# Altium schematic sheet microcontroller.SchDoc
size A
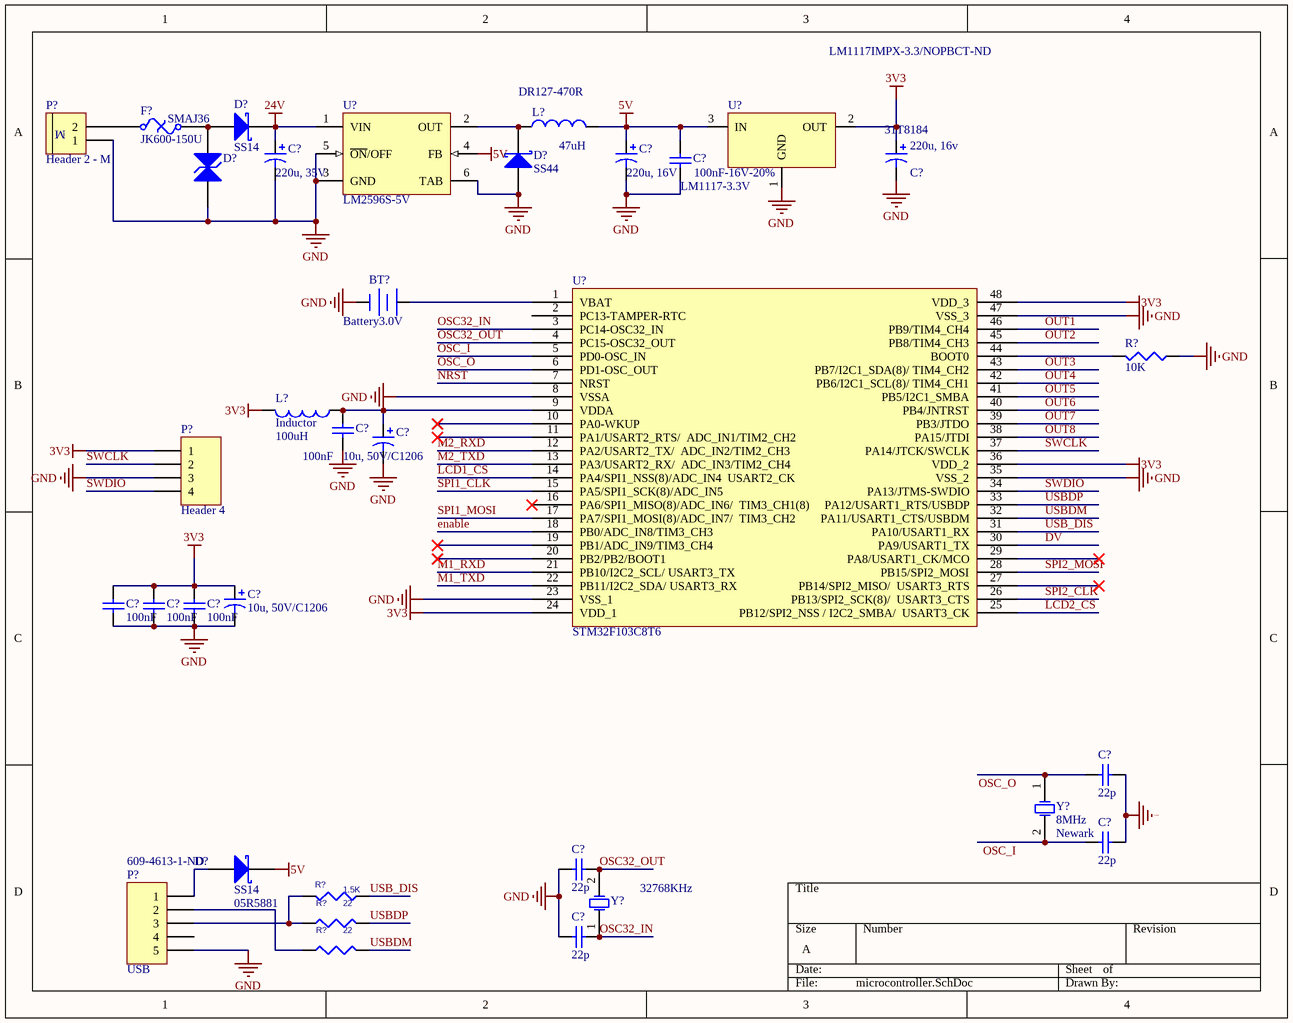
[diagram p0: microcontroller.SchDoc]

## Parts
(Parts that share a designator on the sheet are numbered #1, #2 ... from top to bottom, then left to right.)
BT?  Battery3.0V  [CR1220]
C?#1  value 220u, 35V  [CAPACITOR SIZE_G(D10.3)]  (hidden comment: Cap Pol3)
C?#2  value 220u, 16V  [CAPACITOR SIZE_D(D6.6)]  (hidden comment: Cap Pol3)
C?#3  100nF-16V-20%  [C0805]
C?#4  220u, 16v  Supplier Part Number 1: 31T8184  [CAPACITOR SIZE_D(D6.6)]
C?#5  100nF  [C0805]
C?#6  value 10u, 50V/C1206  [C1206]  (hidden comment: Cap Pol3)
C?#7  value 10u, 50V/C1206  [C1206]  (hidden comment: Cap Pol3)
C?#8  100nF  [C0805]
C?#9  100nF  [C0805]
C?#10  100nF  [C0805]
C?#11  22p  [C0805]
C?#12  22p  [C0805]
C?#13  22p  [C0805]
C?#14  22p  [C0805]
D?#1  SS14  [DO-214AC (SMA)]
D?#2  SS44  [DO-214AC (SMA)]
D?#3  SMAJ36  [DO-214AC (SMA)]
D?#4  SS14  Supplier Part Number 1: 05R5881  [DO-214AC (SMA)]
F?  JK600-150U  [PTC1812]
L?#1  DR127-470R  value 47uH  [LDR127]
L?#2  Inductor  value 100uH  [L0805]
P?#1  Header 2 - M  [Medium - Header 2]
P?#2  Header 4  [HDR1X4]
P?#3  USB  Supplier Part Number 1: 609-4613-1-ND  [Micro_USB_B]
R?#1  10K  [R0805]
R?#2  1.5K  [R0805]
R?#3  22  [R0805]
R?#4  22  [R0805]
U?#1  LM2596S-5V  [TO263-5-TOP]
U?#2  LM1117-3.3V  Supplier Part Number 1: LM1117IMPX-3.3/NOPBCT-ND  [LM1117-SOP]
U?#3  STM32F103C8T6  [TQFP-48-P0.5]
Y?#1  8MHz  Supplier 1: Newark  [HC49/US]
Y?#2  32768KHz  [Cylindrical crystal]

## Nets
3V3: C?#4.1 C?#7.1 C?#8.2 C?#9.2 C?#10.2 L?#2.2 P?#2.1 U?#2.2(OUT) U?#3.24(VDD_1) U?#3.36(VDD_2) U?#3.48(VDD_3)
5V: C?#2.1 C?#3.1 D?#4.2(K) L?#1.2 U?#1.4(FB) U?#2.3(IN)
24V: C?#1.1 D?#1.2(K) U?#1.1(VIN)
GND: BT?.2(-) C?#1.2 C?#2.2 C?#3.2 C?#4.2 C?#5.1 C?#6.2 C?#7.2 C?#8.1 C?#9.1 C?#10.1 C?#11.1 C?#12.1 C?#13.1 C?#14.1 D?#2.1(A) D?#3.1(A) P?#1.1 P?#2.3 P?#3.5 R?#1.1 U?#1.3(GND) U?#1.5(~{ON}/OFF) U?#1.6(TAB) U?#2.1(GND) U?#3.8(VSSA) U?#3.23(VSS_1) U?#3.35(VSS_2) U?#3.47(VSS_3)
DV: U?#3.30(PA9/USART1_TX)
enable: U?#3.18(PB0/ADC_IN8/TIM3_CH3)
LCD1_CS: U?#3.14(PA4/SPI1_NSS(8)/ADC_IN4__USART2_CK)
LCD2_CS: U?#3.25(PB12/SPI2_NSS_/_I2C2_SMBA/__USART3_CK)
M1_RXD: U?#3.21(PB10/I2C2_SCL/_USART3_TX)
M1_TXD: U?#3.22(PB11/I2C2_SDA/_USART3_RX)
M2_RXD: U?#3.12(PA2/USART2_TX/__ADC_IN2/TIM2_CH3)
M2_TXD: U?#3.13(PA3/USART2_RX/__ADC_IN3/TIM2_CH4)
NRST: U?#3.7(NRST)
OSC32_IN: C?#14.2 U?#3.3(PC14-OSC32_IN) Y?#2.1(OSC1)
OSC32_OUT: C?#12.2 U?#3.4(PC15-OSC32_OUT) Y?#2.2(OSC2)
OSC_I: C?#13.2 U?#3.5(PD0-OSC_IN) Y?#1.2(OSC2)
OSC_O: C?#11.2 U?#3.6(PD1-OSC_OUT) Y?#1.1(OSC1)
OUT1: U?#3.46(PB9/TIM4_CH4)
OUT2: U?#3.45(PB8/TIM4_CH3)
OUT3: U?#3.43(PB7/I2C1_SDA(8)/_TIM4_CH2)
OUT4: U?#3.42(PB6/I2C1_SCL(8)/_TIM4_CH1)
OUT5: U?#3.41(PB5/I2C1_SMBA)
OUT6: U?#3.40(PB4/JNTRST)
OUT7: U?#3.39(PB3/JTDO)
OUT8: U?#3.38(PA15/JTDI)
SPI1_CLK: U?#3.15(PA5/SPI1_SCK(8)/ADC_IN5)
SPI1_MOSI: U?#3.17(PA7/SPI1_MOSI(8)/ADC_IN7/__TIM3_CH2)
SPI2_CLK: U?#3.26(PB13/SPI2_SCK(8)/__USART3_CTS)
SPI2_MOSI: U?#3.28(PB15/SPI2_MOSI)
SWCLK: P?#2.2 U?#3.37(PA14/JTCK/SWCLK)
SWDIO: P?#2.4 U?#3.34(PA13/JTMS-SWDIO)
USB_DIS: R?#2.1 U?#3.31(PA10/USART1_RX)
USBDM: R?#4.2 U?#3.32(PA11/USART1_CTS/USBDM)
USBDP: R?#3.2 U?#3.33(PA12/USART1_RTS/USBDP)
NetBT?_1: BT?.1(+) U?#3.1(VBAT)
NetC?#5_2: C?#5.2 C?#6.1 L?#2.1 U?#3.9(VDDA)
NetD?#1_1: D?#1.1(A) D?#3.2(K) F?.1
NetD?#2_2: D?#2.2(K) L?#1.1 U?#1.2(OUT)
NetD?#4_1: D?#4.1(A) P?#3.1
NetF?_2: F?.2 P?#1.2
NetP?#3_2: P?#3.2 R?#4.1
NetP?#3_3: P?#3.3 R?#2.2 R?#3.1
NetR?#1_2: R?#1.2 U?#3.44(BOOT0)

Not connected (* = marked no-connect by the designer): P?#3 4; U?#3 2(PC13-TAMPER-RTC) 10(PA0-WKUP)* 11(PA1/USART2_RTS/__ADC_IN1/TIM2_CH2)* 16(PA6/SPI1_MISO(8)/ADC_IN6/__TIM3_CH1(8))* 19(PB1/ADC_IN9/TIM3_CH4)* 20(PB2/PB2/BOOT1)* 27(PB14/SPI2_MISO/__USART3_RTS)* 29(PA8/USART1_CK/MCO)*

## Notes on the sheet
- (in symbol Header 2 - M) M

## Library data of the parts
BT? = Battery3.3V: Multicell Battery; Published: 24-Mar-1999; LatestRevisionDate: 17-Jul-2002; LatestRevisionNote: Re-released for DXP Platform.; PackageReference: BAT-2; Publisher: Altium Limited
C?#1 C?#2 C?#6 C?#7 = Cap Pol3: Polarized Capacitor (Surface Mount); Manufacturer: Kemet; Manufacturer Part Number: C0603C103K5RACTU; Capacitance: 10000pF; Voltage - Rated: 50V; Tolerance: ±10%; Temperature Coefficient: X7R; Published: 8-Jun-2000; LatestRevisionDate: 29-May-2009; LatestRevisionNote: IPC-7351 Footprint Added.; PackageReference: C0805; Publisher: Altium Limited; PackageDescription: Chip Capacitor; Supplier 1: Digi-Key; Supplier Part Number 1: 399-1091-1-ND; RoHS: RoHS Compliant; Category: Capacitors; Stock 1: 1592048; Pricing 1: 1=0.1, 10=0.019, 50=0.0104, 100=0.0088, 250=0.0072, 500=0.00616, 1000=0.0048 (USD); Packaging: Cut Tape (CT); Mounting Type: Surface Mount, MLCC; Operating Temperature: -55°C ~ 125°C; Applications: General Purpose; Ratings: -; Package/Case: 0603 (1608 Metric); Size / Dimension: 0.063" L x 0.031" W (1.60mm x 0.80mm); Height - Seated (Max): -; Thickness (Max): 0.034" (0.87mm); Lead Spacing: -; Features: -; Lead Style: -; ComponentLink1URL: http://www.kemet.com/datasheets&C0603C103K5RACTU; ComponentLink1Description: http://www.kemet.com/datasheets&C0603C103K5RACTU; Supplier 2: Digi-Key; Supplier Part Number 2: 587-2994-1-ND; Stock 2: 102954; Pricing 2: 1=0.28, 10=0.19, 50=0.115, 100=0.0966, 250=0.0782, 500=0.069, 1000=0.05865 (USD); ComponentLink2URL: http://www.yuden.co.jp/or/product/category/capacitor/UMK316AB7475KL-T.pdf; ComponentLink2Description: http://www.yuden.co.jp/or/product/category/capacitor/UMK316AB7475KL-T.pdf
C?#3 = Cap: CAP CER 0.1UF 16V Y5V 0603; Manufacturer: Yageo; Manufacturer Part Number: CC0603ZRY5V7BB104; Published: 8-Jun-2000; LatestRevisionDate: 17-Jul-2002; LatestRevisionNote: Re-released for DXP Platform.; PackageReference: C0603; Publisher: Altium Limited; Value: 100nF-16V-20%; Digi-Key Part Number: 311-1369-1-ND; Unit Price: 0.00648
C?#4 = Cap Pol3: Polarized Capacitor (Surface Mount); Published: 8-Jun-2000; LatestRevisionDate: 29-May-2009; LatestRevisionNote: IPC-7351 Footprint Added.; PackageReference: C0805; Publisher: Altium Limited; PackageDescription: Chip Capacitor; Supplier 1: Newark
C?#5 C?#8-C?#14 = Cap Semi: Capacitor (Semiconductor SIM Model); Published: 8-Jun-2000; LatestRevisionDate: 29-May-2009; LatestRevisionNote: IPC-7351 Footprint Added.; PackageReference: C1206; Publisher: Altium Limited; PackageDescription: Chip Capacitor
D?#1 D?#2 D?#4 = D Schottky: Schottky Diode; Published: 8-Jun-2000; LatestRevisionDate: 17-Jul-2002; LatestRevisionNote: Re-released for DXP Platform.; PackageReference: SMB; Publisher: Altium Limited; Code_JEDEC: DO-214-AA
  D?#2 D?#4: Supplier 1: Newark
D?#3 = Diode_TVS
F? = Fuse Thermal: Thermal Fuse; Published: 24-Mar-1999; LatestRevisionDate: 17-Jul-2002; LatestRevisionNote: Re-released for DXP Platform.; PackageReference: PIN-W2/E2.8; Publisher: Altium Limited
L?#1 = Inductor: SD8350-4R7-R; Code_IEC: 1005; Published: 8-Jun-2000; LatestRevisionDate: 29-May-2009; LatestRevisionNote: IPC-7351 Footprint Added.; PackageReference: 0402-A; Publisher: Altium Limited; PackageDescription: Chip Inductor; Code_JEITA: 0402; Supplier 1: Newark
L?#2 = Inductor: Code_IEC: 1005; Published: 8-Jun-2000; LatestRevisionDate: 29-May-2009; LatestRevisionNote: IPC-7351 Footprint Added.; PackageReference: 0402-A; Publisher: Altium Limited; PackageDescription: Chip Inductor; Code_JEITA: 0402
P?#1 = Header 2 - M: Header, 2-Pin, Medium; LatestRevisionDate: 17-Jul-2002; LatestRevisionNote: Re-released for DXP Platform.; Publisher: Altium Limited
P?#2 = Header 4: Header, 4-Pin; LatestRevisionDate: 17-Jul-2002; LatestRevisionNote: Re-released for DXP Platform.; Publisher: Altium Limited
P?#3 = Header 5: Header, 5-Pin; LatestRevisionDate: 17-Jul-2002; LatestRevisionNote: Re-released for DXP Platform.; Publisher: Altium Limited; Supplier 1: Digi-Key
R?#1 = Res3: Resistor 10k 0603; Published: 8-Jun-2000; LatestRevisionDate: 29-May-2009; LatestRevisionNote: IPC-7351 Footprint Added.; PackageReference: J1-0603; Publisher: Altium Limited; PackageDescription: Chip Resistor
R?#2-R?#4 = R
U?#1 = LM2596S-ADJ: SIMPLE SWITCHER Power Converter 150 KHz 3A Step-Down Voltage Regulator; Manufacturer: National Semiconductor; PackageTopMarking: NSUZXYTT*LM2596S*-ADJ P+; PowerWise: N; FirstPublished: 4-Dec-2008; DatasheetVersion: May-2002; PackageVersion: revD, Apr-2005; PackageReference: TS5B; Publisher: Altium Limited; PackageDescription: TO-263, Molded, .400 x .390 x .180in, 5 Lead, .067in Pitch, Surface Mount; CompType: Switcher; PartNumber: LM2596S-ADJ; RoHS: O; PinCount: 5; DigiKeyPartNumber: LM2596S-ADJ-ND; Code_JEDEC: MO-169-AB; ComponentLink1Description: LM2596 Datasheet; ComponentLink1URL: http://www.national.com/ds/LM/LM2596.pdf; ComponentLink2Description: LM2596 Web Page; ComponentLink2URL: http://www.national.com/pf/LM/LM2596.html; ComponentLink3Description: TS5B Package Page; ComponentLink3URL: http://www.national.com/packaging/folders/ts5b.html; Supplier 1: Digi-Key
U?#2 = LM1117: 800mA Low-Dropout Linear Regulator; Creator: Nguyen Ba Bien; Website: http://group3i.net; Supplier 1: Digi-Key
U?#3 = STM32F103C8T6: 48pins, 64 KBytes Flash, 20 KBytes SRAM, 1x I2C, 1x SPI (18 Mbit/s); Datasheet: http://www.st.com/internet/com/TECHNICAL_RESOURCES/TECHNICAL_LITERATURE/DATASHEET/CD00210831.pdf
Y?#1 Y?#2 = XTAL: Crystal Oscillator; Published: 8-Jun-2000; LatestRevisionDate: 17-Jul-2002; LatestRevisionNote: Re-released for DXP Platform.; PackageReference: R38; Publisher: Altium Limited
  Y?#1: Supplier Part Number 1: 90B5422
  Y?#2: Supplier 1: Newark; Supplier Part Number 1: 96F2829